# Altium schematic sheet Connections.SchDoc
size A; SheetNumber: 2; SheetTotal: 2
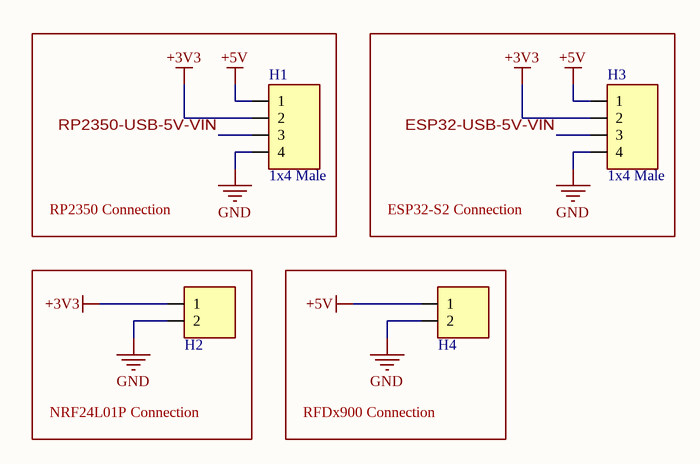
[diagram p0: Connections.SchDoc]

## Parts
H1  1x4 Male  [[Header] Shrouded 1x4 Male]
H2  1x2 Male  [[Header] Shrouded 1x2 Male]  (value not drawn)
H3  1x4 Male  [[Header] Shrouded 1x4 Male]
H4  1x2 Male  [[Header] Shrouded 1x2 Male]  (value not drawn)

## Blocks framed on the sheet
RP2350 Connection: H1
ESP32-S2 Connection: H3
NRF24L01P Connection: H2
RFDx900 Connection: H4

## Nets
+3V3: H1.2 H2.1 H3.2
+5V: H1.1 H3.1 H4.1
GND: H1.4 H2.2 H3.4 H4.2
ESP32-USB-5V-VIN: H3.3
RP2350-USB-5V-VIN: H1.3

## Library data of the parts
H1 H3 = [Header] Shrouded 1x4 Male: 70543-0003 / Mates with 005057-9404; Supplier 1: Avnet; Supplier Part Number 1: 0705430003
H2 H4 = [Header] Shrouded 1x2 Male: 0705430036 / Mates with 0050579402; Supplier 1: DigiKey; Supplier 2: DigiKey; Supplier Part Number 2: WM2900-ND; Supplier Part Number 1: WM4824-ND